# Altium project ServoInterface.PrjPCB
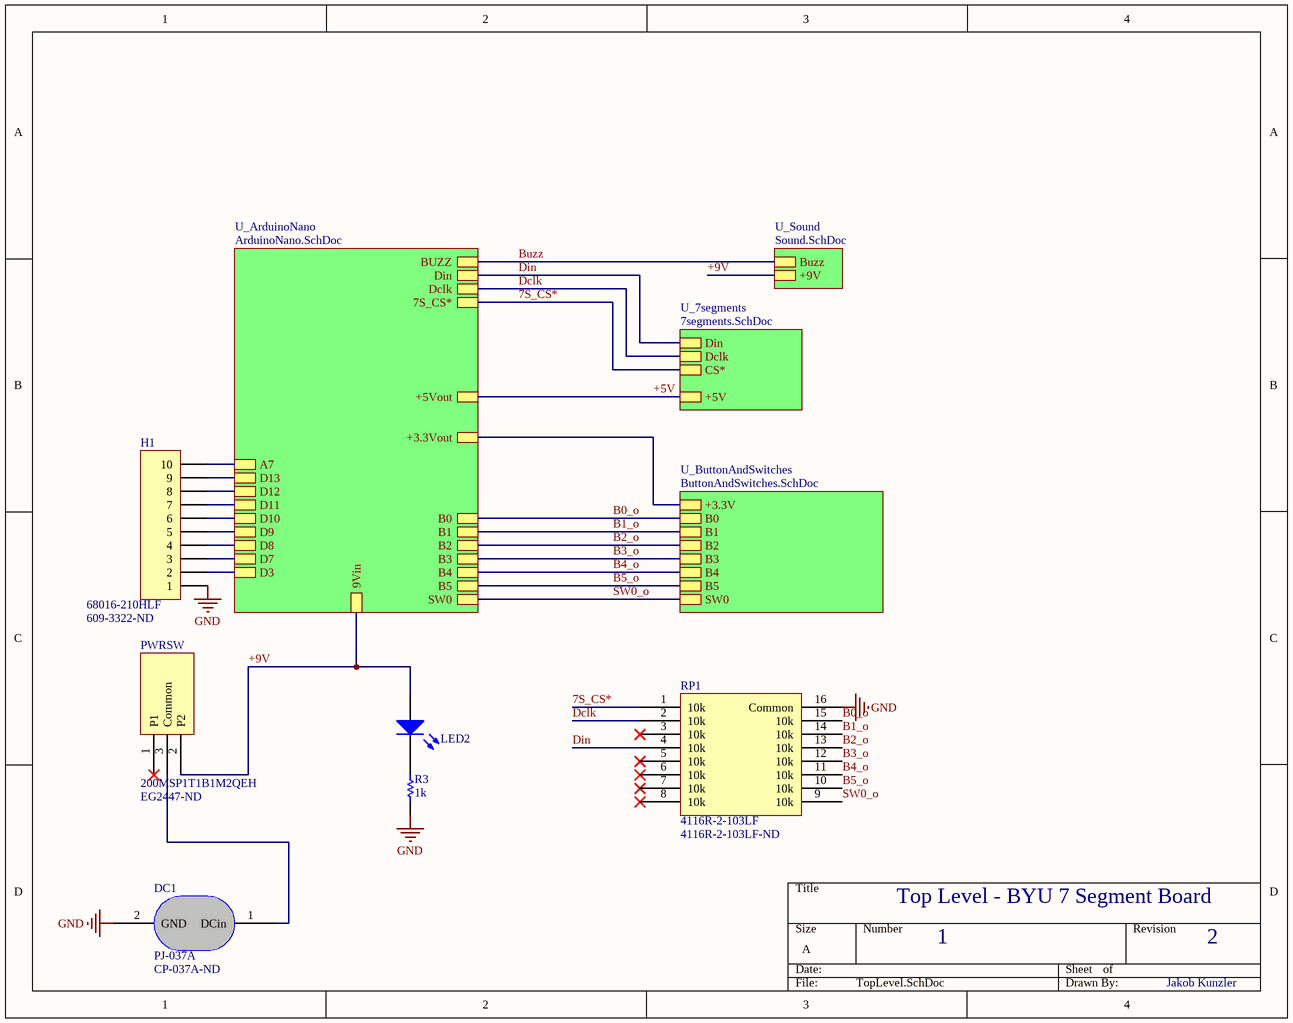
[diagram p0: TopLevel.SchDoc]
5 sheets, 26 parts. Net scope: hierarchical (ports join the sheet entries above them; power ports are global).
Board file: ServoInterface.PcbDoc
Sheets:
  TopLevel.SchDoc
    U_7segments = 7segments.SchDoc
    U_Sound = Sound.SchDoc
    U_ButtonAndSwitches = ButtonAndSwitches.SchDoc
    U_ArduinoNano = ArduinoNano.SchDoc

## Sheet TopLevel.SchDoc
size A

### Parts
DC1  PJ-037A  Supplier Part Number 1: CP-037A-ND  [PJ-037A]
H1  68016-210HLF  Supplier Part Number 1: 609-3322-ND  [Header1X10]
LED2  LTL-4223  [LED Through]  (value not drawn)
PWRSW  200MSP1T1B1M2QEH  Supplier Part Number 1: EG2447-ND  [200MSP1T1B1M2QEH]
R3  1k  [Resistor Through Hole]
RP1  4116R-2-103LF  Supplier Part Number 1: 4116R-2-103LF-ND  [4100R]

### Sub-sheets
U_7segments = 7segments.SchDoc: Din, CS*, Dclk, +5V
U_ArduinoNano = ArduinoNano.SchDoc: Din, D3, Dclk, 7S_CS*, SW0, B5, B4, B3, B2, B1, B0, 9Vin, +5Vout, A7, D13, D12, D11, D10, D9, D8, D7, +3.3Vout, BUZZ
U_ButtonAndSwitches = ButtonAndSwitches.SchDoc: +3.3V, B0, B1, B2, B3, B4, B5, SW0
U_Sound = Sound.SchDoc: Buzz, +9V

### Nets
GND: DC1.2(GND) H1.1 R3.2 RP1.16(Common)
7S_CS*: RP1.1(10k) ; sheet U_7segments/CS*, sheet U_ArduinoNano/7S_CS*
+3.3V: sheet U_ButtonAndSwitches/+3.3V, sheet U_ArduinoNano/+3.3Vout
+5V: sheet U_7segments/+5V, sheet U_ArduinoNano/+5Vout
+9V: LED2.1(A) PWRSW.2(P2) ; sheet U_Sound/+9V, sheet U_ArduinoNano/9Vin
A7: H1.10 ; sheet U_ArduinoNano/A7
B0_o: RP1.15(10k) ; sheet U_ButtonAndSwitches/B0, sheet U_ArduinoNano/B0
B1_o: RP1.14(10k) ; sheet U_ButtonAndSwitches/B1, sheet U_ArduinoNano/B1
B2_o: RP1.13(10k) ; sheet U_ButtonAndSwitches/B2, sheet U_ArduinoNano/B2
B3_o: RP1.12(10k) ; sheet U_ButtonAndSwitches/B3, sheet U_ArduinoNano/B3
B4_o: RP1.11(10k) ; sheet U_ButtonAndSwitches/B4, sheet U_ArduinoNano/B4
B5_o: RP1.10(10k) ; sheet U_ButtonAndSwitches/B5, sheet U_ArduinoNano/B5
Buzz: sheet U_Sound/Buzz, sheet U_ArduinoNano/BUZZ
D3: H1.2 ; sheet U_ArduinoNano/D3
D7: H1.3 ; sheet U_ArduinoNano/D7
D8: H1.4 ; sheet U_ArduinoNano/D8
D9: H1.5 ; sheet U_ArduinoNano/D9
D10: H1.6 ; sheet U_ArduinoNano/D10
D11: H1.7 ; sheet U_ArduinoNano/D11
D12: H1.8 ; sheet U_ArduinoNano/D12
D13: H1.9 ; sheet U_ArduinoNano/D13
Dclk: RP1.2(10k) ; sheet U_7segments/Dclk, sheet U_ArduinoNano/Dclk
Din: RP1.4(10k) ; sheet U_7segments/Din, sheet U_ArduinoNano/Din
SW0_o: RP1.9(10k) ; sheet U_ButtonAndSwitches/SW0, sheet U_ArduinoNano/SW0
NetDC1_1: DC1.1(DCin) PWRSW.3(Common)
NetLED2_2: LED2.2(K) R3.1

Not connected (* = marked no-connect by the designer): PWRSW 1(P1)*; RP1 3(10k)* 5(10k)* 6(10k)* 7(10k)* 8(10k)*

### Notes on the sheet
- Top Level - BYU 7 Segment Board
- 1
- 2
- Jakob Kunzler

### Library data of the parts
DC1 = DCpowerBarrel: CONN PWR JACK 2X5.5MM SOLDER; ComponentLink1Description: CP-037A-ND; ComponentLink1URL: https://www.digikey.com/product-detail/en/cui-inc/PJ-037A/CP-037A-ND/1644545; Supplier 1: Digi-Key
H1 = Header 10 Right Angle 100 mil: LatestRevisionDate: 17-Jul-2002; LatestRevisionNote: Re-released for DXP Platform.; Publisher: Altium Limited; Supplier 1: Digi-Key
LED2 = LED_RED: 2 V drop 10 mA Red; ComponentLink1Description: 160-1127-ND; ComponentLink1URL: https://www.digikey.com/product-detail/en/lite-on-inc/LTL-4223/160-1127-ND/200395; Supplier 1: Digi-Key
PWRSW = PowerSwitch: SWITCH TOGGLE SPDT 3A 120V; ComponentLink1Description: EG2447-ND; ComponentLink1URL: https://www.digikey.com/product-detail/en/e-switch/200MSP1T1B1M2QEH/EG2447-ND/378916; Supplier 1: Digi-Key
R3 = Resistor_1k: CF14JT1K00; Supplier 1: Digi-Key; ComponentLink1Description: CF14JT1K00TR-ND; ComponentLink1URL: https://www.digikey.com/product-detail/en/stackpole-electronics-inc/CF14JT1K00/CF14JT1K00TR-ND/1741314
RP1 = ResistorPack15: Supplier 1: Digi-Key

## Sheet 7segments.SchDoc
size A
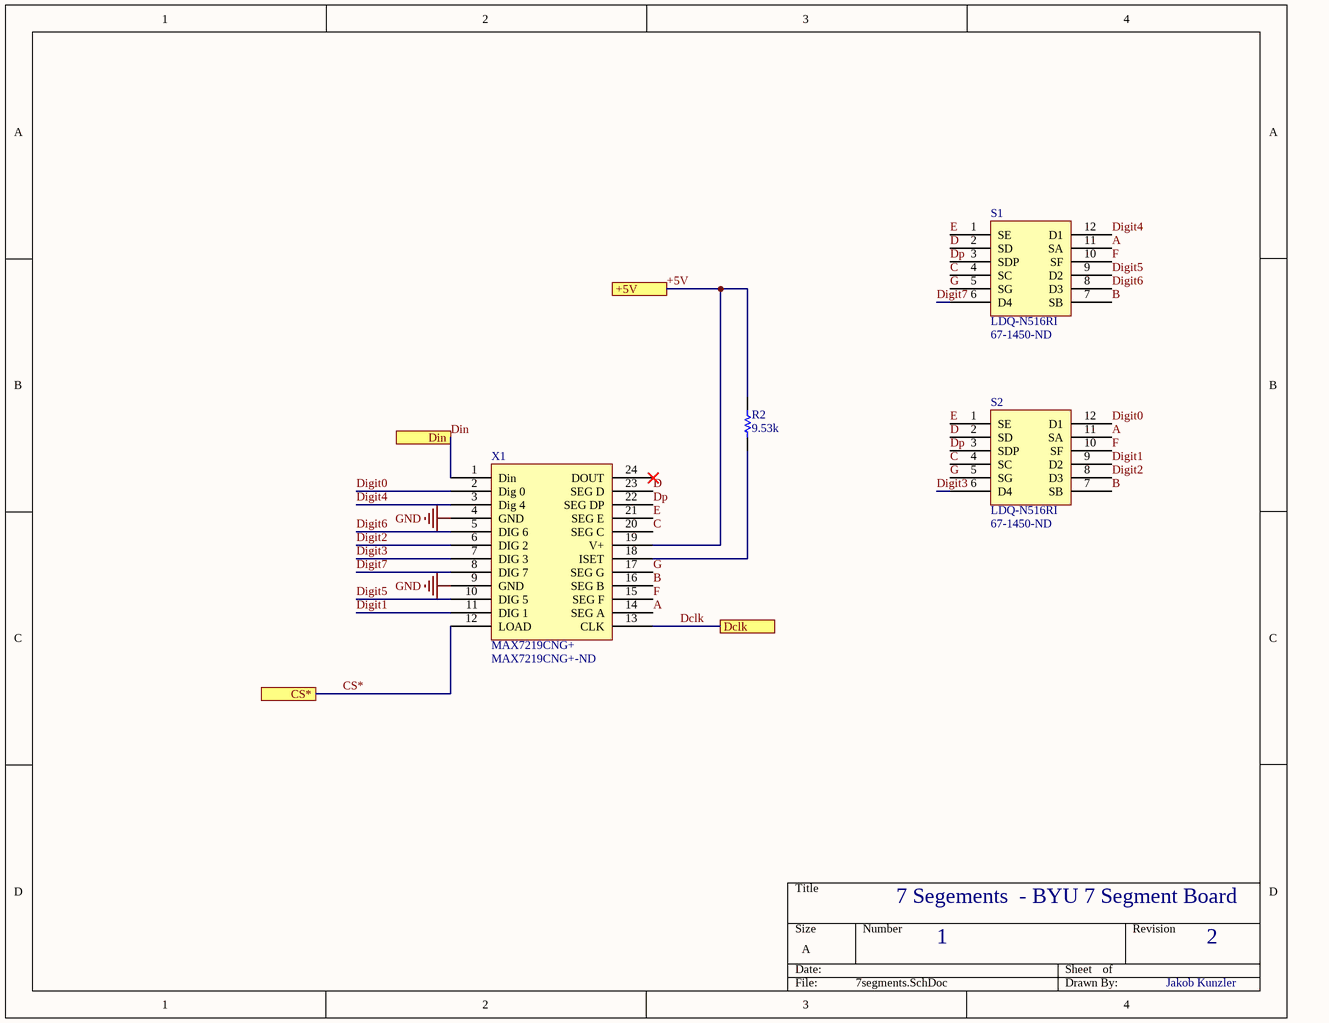
[diagram p1: 7segments.SchDoc]

### Parts
R2  9.53k  [Resistor Through Hole]
S1  LDQ-N516RI  Supplier Part Number 1: 67-1450-ND  [LDQ-516RI]
S2  LDQ-N516RI  Supplier Part Number 1: 67-1450-ND  [LDQ-516RI]
X1  MAX7219CNG+  Supplier Part Number 1: MAX7219CNG+-ND  [MAX7219]

### Ports
+5V, CS*, Dclk, Din

### Nets
GND: X1.4(GND) X1.9(GND)
+5V: R2.2 X1.19(V+) ; port +5V
A: S1.11(SA) S2.11(SA) X1.14(SEG_A)
B: S1.7(SB) S2.7(SB) X1.16(SEG_B)
C: S1.4(SC) S2.4(SC) X1.20(SEG_C)
CS*: X1.12(LOAD) ; port CS*  [project net 7S_CS*]
D: S1.2(SD) S2.2(SD) X1.23(SEG_D)
Dclk: X1.13(CLK) ; port Dclk
Digit0: S2.12(D1) X1.2(Dig_0)
Digit1: S2.9(D2) X1.11(DIG_1)
Digit2: S2.8(D3) X1.6(DIG_2)
Digit3: S2.6(D4) X1.7(DIG_3)
Digit4: S1.12(D1) X1.3(Dig_4)
Digit5: S1.9(D2) X1.10(DIG_5)
Digit6: S1.8(D3) X1.5(DIG_6)
Digit7: S1.6(D4) X1.8(DIG_7)
Din: X1.1(Din) ; port Din
Dp: S1.3(SDP) S2.3(SDP) X1.22(SEG_DP)
E: S1.1(SE) S2.1(SE) X1.21(SEG_E)
F: S1.10(SF) S2.10(SF) X1.15(SEG_F)
G: S1.5(SG) S2.5(SG) X1.17(SEG_G)
NetR2_1: R2.1 X1.18(ISET)

Not connected (* = marked no-connect by the designer): X1 24(DOUT)*

### Notes on the sheet
- 7 Segements  - BYU 7 Segment Board
- 1
- 2
- Jakob Kunzler

### Library data of the parts
R2 = Resistor_9.53k: MFR-25FBF52-9K53; ComponentLink1Description: 9.53KXBK-ND; ComponentLink1URL: https://www.digikey.com/product-detail/en/yageo/MFR-25FBF52-9K53/9.53KXBK-ND/13215; Supplier 1: Digi-Key
S1 S2 = SevenSegment: LED 7-SEG .56 QUAD S-RED CC MULT; ComponentLink1Description: 67-1450-ND; ComponentLink1URL: https://www.digikey.com/products/en?keywords=LDQ-N516RI; Supplier 1: Digi-Key
X1 = MAX7219: Serially Interfaced, 8-Digit LED Display Driver; ComponentLink1Description: MAX7219CNG+-ND; ComponentLink1URL: https://www.digikey.com/product-detail/en/maxim-integrated/MAX7219CNG/MAX7219CNG-ND/948191; Supplier 1: Digi-Key

## Sheet Sound.SchDoc
size A
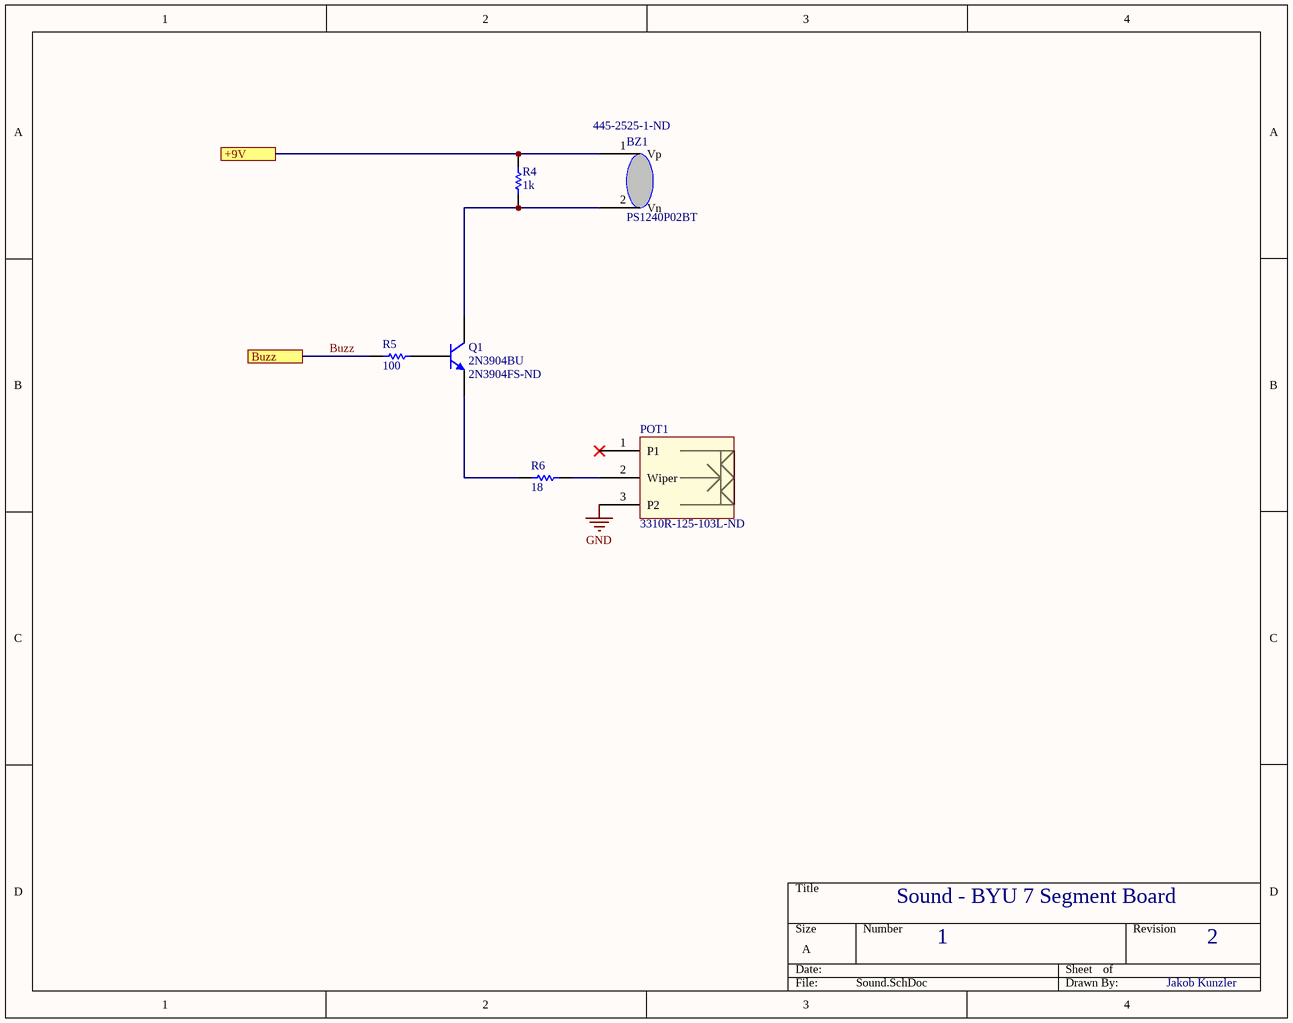
[diagram p2: Sound.SchDoc]

### Parts
BZ1  PS1240P02BT  Supplier Part Number 1: 445-2525-1-ND  [PS1240P02BT]
POT1  Supplier Part Number 1: 3310R-125-103L-ND  [3310R-001]  (hidden comment: 3310R-125-103L)
Q1  2N3904BU  Supplier Part Number 1: 2N3904FS-ND  [2N3904]
R4  1k  [Resistor Through Hole]
R5  100  [Resistor Through Hole]
R6  18  [Resistor Through Hole]

### Ports
+9V, Buzz

### Nets
GND: POT1.3(P2)
+9V: BZ1.1(Vp) R4.1 ; port +9V
Buzz: R5.2 ; port Buzz
NetBZ1_2: BZ1.2(Vn) Q1.3(C) R4.2
NetPOT1_2: POT1.2(Wiper) R6.1
NetQ1_1: Q1.1(E) R6.2
NetQ1_2: Q1.2(B) R5.1

Not connected (* = marked no-connect by the designer): POT1 1(P1)*

### Notes on the sheet
- Sound - BYU 7 Segment Board
- 1
- 2
- Jakob Kunzler

### Library data of the parts
BZ1 = PS12: Piezo Buzzer, Through Hole; ComponentLink1Description: 445-2525-1-ND; ComponentLink1URL: https://www.digikey.com/product-detail/en/tdk-corporation/PS1240P02BT/445-2525-1-ND/935930; Supplier 1: Digi-Key
POT1 = Potentiometer - 10k: POT 10K OHM 1/4W PLASTIC LINEAR; ComponentLink1Description: 3310R-125-103L-ND; ComponentLink1URL: https://www.digikey.com/product-detail/en/bourns-inc/3310R-125-103L/3310R-125-103L-ND/2537840; Supplier 1: Digi-Key
Q1 = 2N3904: TRANS NPN 40V 0.2A TO-92; Published: 8-Jun-2000; LatestRevisionDate: 15-Jan-2003; LatestRevisionNote: PCB Footprint 'BCY-W3/D4.7' replaced; DatasheetVersion: 1997; PackageVersion: Sep-1998; PackageReference: TO-92A; Publisher: Altium Limited; PackageDescription: TO, Flat Index; 3 In-Line, Axial Leads; Body Dia. 4.5mm; Leads 0.51 x 0.48 mm (max); ComponentLink1Description: Manufacturer Link; ComponentLink1URL: http://www.fairchildsemi.com/; ComponentLink2Description: Datasheet; ComponentLink2URL: http://www.fairchildsemi.com/ds/2N%2F2N3904.pdf; Supplier 1: Digi-Key; ComponentLink3Description: 2N3904FS-ND; ComponentLink3URL: https://www.digikey.com/product-detail/en/on-semiconductor/2N3904BU/2N3904FS-ND/1413
R4 = Resistor_1k: CF14JT1K00; Supplier 1: Digi-Key; ComponentLink1Description: CF14JT1K00TR-ND; ComponentLink1URL: https://www.digikey.com/product-detail/en/stackpole-electronics-inc/CF14JT1K00/CF14JT1K00TR-ND/1741314
R5 = Resistor_100: CF14JT100R; ComponentLink1Description: CF14JT100RCT-ND; ComponentLink1URL: https://www.digikey.com/product-detail/en/stackpole-electronics-inc/CF14JT100R/CF14JT100RCT-ND/1830327; Supplier 1: Digi-Key
R6 = Resistor_18: CF14JT18R0; Supplier 1: Digi-Key

## Sheet ButtonAndSwitches.SchDoc
size A
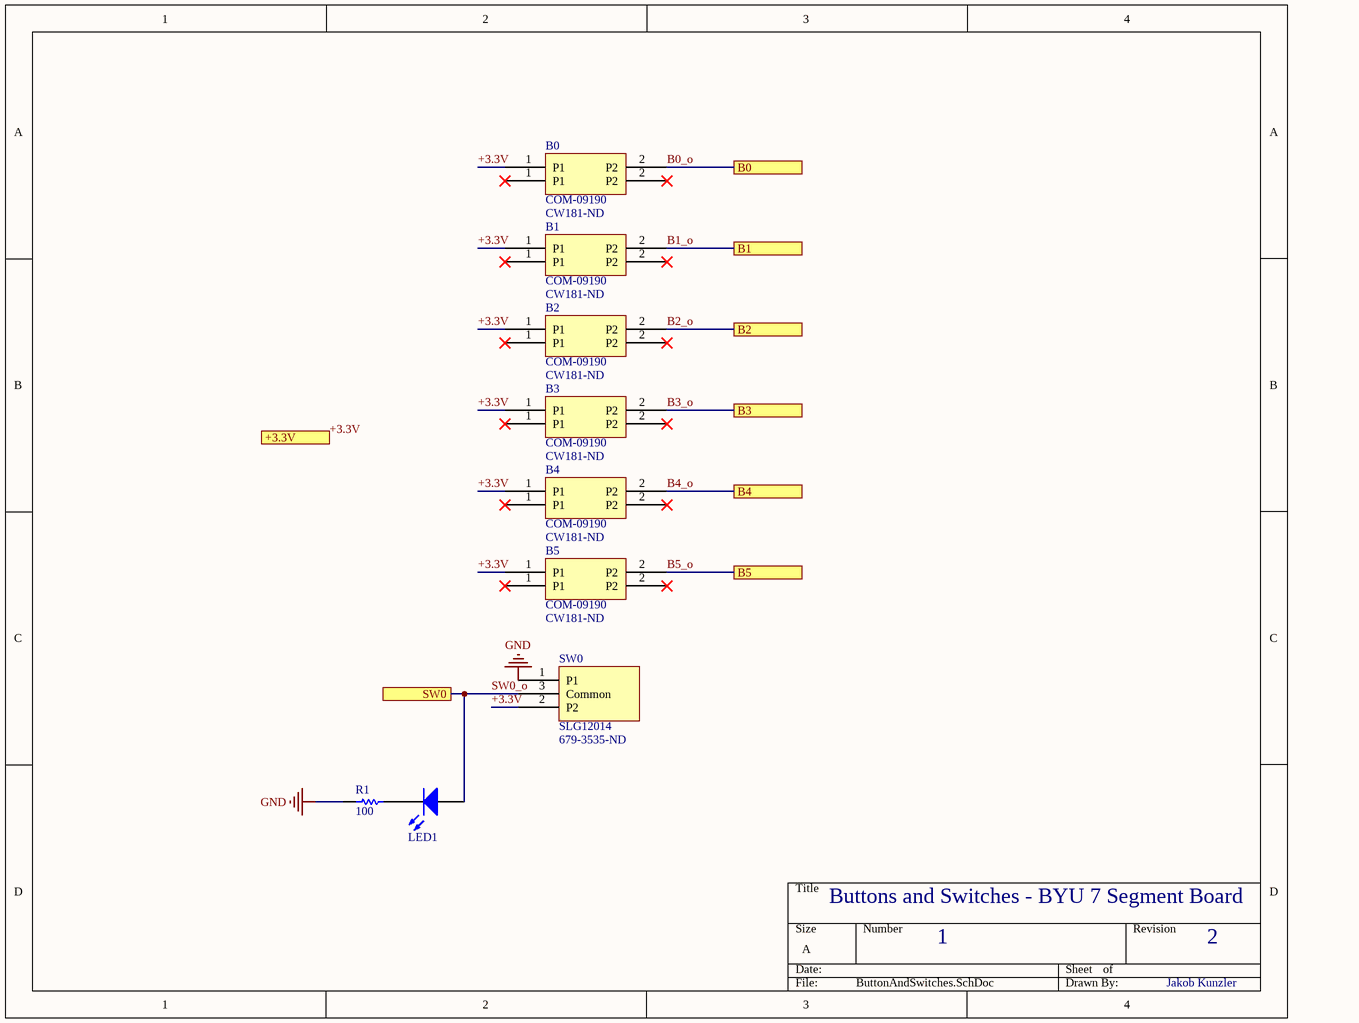
[diagram p3: ButtonAndSwitches.SchDoc]

### Parts
B0  COM-09190  Supplier Part Number 1: CW181-ND  [COM-09190]
B1  COM-09190  Supplier Part Number 1: CW181-ND  [COM-09190]
B2  COM-09190  Supplier Part Number 1: CW181-ND  [COM-09190]
B3  COM-09190  Supplier Part Number 1: CW181-ND  [COM-09190]
B4  COM-09190  Supplier Part Number 1: CW181-ND  [COM-09190]
B5  COM-09190  Supplier Part Number 1: CW181-ND  [COM-09190]
LED1  LTL-4223  [LED Through]  (value not drawn)
R1  100  [Resistor Through Hole]
SW0  SLG12014  Supplier Part Number 1: 679-3535-ND  [SLG12014]

### Ports
+3.3V, B0, B1, B2, B3, B4, B5, SW0

### Nets
GND: R1.2 SW0.1(P1)
+3.3V: B0.1(P1) B1.1(P1) B2.1(P1) B3.1(P1) B4.1(P1) B5.1(P1) SW0.2(P2) ; port +3.3V
B0_o: B0.2(P2) ; port B0
B1_o: B1.2(P2) ; port B1
B2_o: B2.2(P2) ; port B2
B3_o: B3.2(P2) ; port B3
B4_o: B4.2(P2) ; port B4
B5_o: B5.2(P2) ; port B5
SW0_o: LED1.1(A) SW0.3(Common) ; port SW0
NetLED1_2: LED1.2(K) R1.1

### Notes on the sheet
- Buttons and Switches - BYU 7 Segment Board
- 1
- 2
- Jakob Kunzler

### Library data of the parts
B0-B5 = Push Button_Tactile: Momentary Pushbutton Switch - 12mm Square; Supplier 1: Digi-Key; ComponentLink2Description: Momentary Pushbutton Switch - 12mm Square; ComponentLink2URL: https://www.sparkfun.com/products/9190
LED1 = LED_RED: 2 V drop 10 mA Red; ComponentLink1Description: 160-1127-ND; ComponentLink1URL: https://www.digikey.com/product-detail/en/lite-on-inc/LTL-4223/160-1127-ND/200395; Supplier 1: Digi-Key
R1 = Resistor_100: CF14JT100R; ComponentLink1Description: CF14JT100RCT-ND; ComponentLink1URL: https://www.digikey.com/product-detail/en/stackpole-electronics-inc/CF14JT100R/CF14JT100RCT-ND/1830327; Supplier 1: Digi-Key
SW0 = SlideSwitch: SWITCH SLIDE SPDT 300MA 125V; ComponentLink1Description: 679-3535-ND; ComponentLink1URL: https://www.digikey.com/product-detail/en/apem-inc/SLG12014/679-3535-ND/1797348; Supplier 1: Digi-Key

## Sheet ArduinoNano.SchDoc
size A
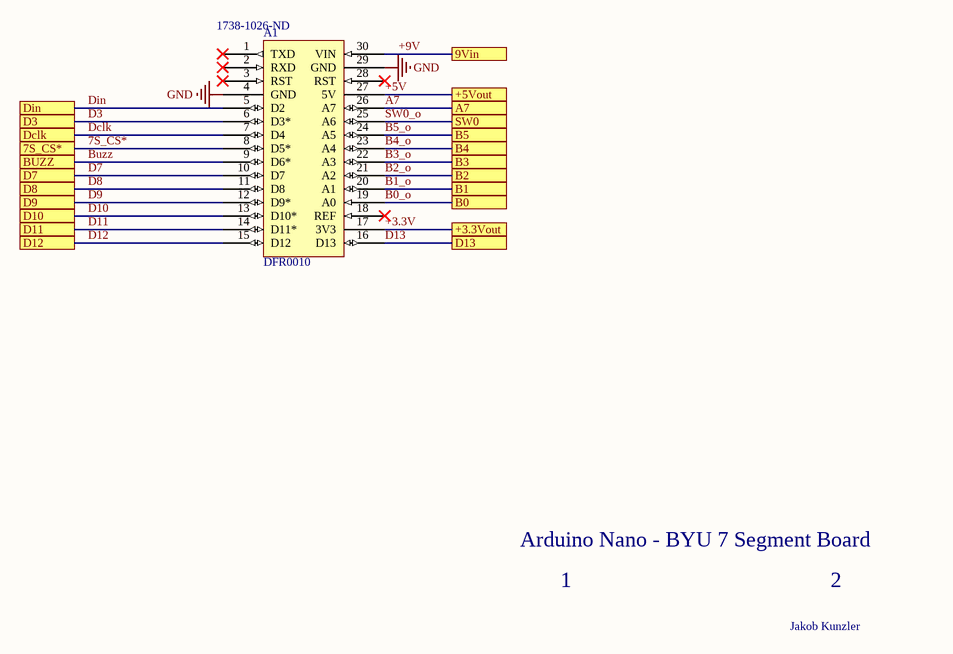
[diagram p4: ArduinoNano.SchDoc]

### Parts
A1  DFR0010  Supplier Part Number 1: 1738-1026-ND  [ArduinoNano]

### Ports
7S_CS*, 9Vin, +3.3Vout, +5Vout, A7, B0, B1, B2, B3, B4, B5, BUZZ, D3, D7, D8, D9, D10, D11, D12, D13, Dclk, Din, SW0

### Nets
GND: A1.4(GND) A1.29(GND)
7S_CS*: A1.8(D5*) ; port 7S_CS*
+3.3V: A1.17(3V3) ; port +3.3Vout
+5V: A1.27(5V) ; port +5Vout
+9V: A1.30(VIN) ; port 9Vin
A7: A1.26(A7) ; port A7
B0_o: A1.19(A0) ; port B0
B1_o: A1.20(A1) ; port B1
B2_o: A1.21(A2) ; port B2
B3_o: A1.22(A3) ; port B3
B4_o: A1.23(A4) ; port B4
B5_o: A1.24(A5) ; port B5
Buzz: A1.9(D6*) ; port BUZZ
D3: A1.6(D3*) ; port D3
D7: A1.10(D7) ; port D7
D8: A1.11(D8) ; port D8
D9: A1.12(D9*) ; port D9
D10: A1.13(D10*) ; port D10
D11: A1.14(D11*) ; port D11
D12: A1.15(D12) ; port D12
D13: A1.16(D13) ; port D13
Dclk: A1.7(D4) ; port Dclk
Din: A1.5(D2) ; port Din
SW0_o: A1.25(A6) ; port SW0

Not connected (* = marked no-connect by the designer): A1 1(TXD)* 2(RXD)* 3(RST)* 18(REF)* 28(RST)*

### Notes on the sheet
- Arduino Nano - BYU 7 Segment Board
- 1
- 2
- Jakob Kunzler

### Library data of the parts
A1 = ArduinoNano: DFRDUINO NANO V3.1 (ARDUINO NANO; ComponentLink1Description: 1738-1026-ND; ComponentLink1URL: https://www.digikey.com/product-detail/en/dfrobot/DFR0010/1738-1026-ND/6588448; Supplier 1: Digi-Key

## Nets that join several sheets
GND: TopLevel (DC1.2 H1.1 R3.2 RP1.16), 7segments (X1.4 X1.9), Sound (POT1.3), ButtonAndSwitches (R1.2 SW0.1), ArduinoNano (A1.4 A1.29)
7S_CS*: TopLevel (RP1.1), 7segments (X1.12), ArduinoNano (A1.8)
+3.3V: ButtonAndSwitches (7 pins), ArduinoNano (A1.17)
+5V: 7segments (R2.2 X1.19), ArduinoNano (A1.27)
+9V: TopLevel (LED2.1 PWRSW.2), Sound (BZ1.1 R4.1), ArduinoNano (A1.30)
A7: TopLevel (H1.10), ArduinoNano (A1.26)
B0_o: TopLevel (RP1.15), ButtonAndSwitches (B0.2), ArduinoNano (A1.19)
B1_o: TopLevel (RP1.14), ButtonAndSwitches (B1.2), ArduinoNano (A1.20)
B2_o: TopLevel (RP1.13), ButtonAndSwitches (B2.2), ArduinoNano (A1.21)
B3_o: TopLevel (RP1.12), ButtonAndSwitches (B3.2), ArduinoNano (A1.22)
B4_o: TopLevel (RP1.11), ButtonAndSwitches (B4.2), ArduinoNano (A1.23)
B5_o: TopLevel (RP1.10), ButtonAndSwitches (B5.2), ArduinoNano (A1.24)
Buzz: Sound (R5.2), ArduinoNano (A1.9)
D3: TopLevel (H1.2), ArduinoNano (A1.6)
D7: TopLevel (H1.3), ArduinoNano (A1.10)
D8: TopLevel (H1.4), ArduinoNano (A1.11)
D9: TopLevel (H1.5), ArduinoNano (A1.12)
D10: TopLevel (H1.6), ArduinoNano (A1.13)
D11: TopLevel (H1.7), ArduinoNano (A1.14)
D12: TopLevel (H1.8), ArduinoNano (A1.15)
D13: TopLevel (H1.9), ArduinoNano (A1.16)
Dclk: TopLevel (RP1.2), 7segments (X1.13), ArduinoNano (A1.7)
Din: TopLevel (RP1.4), 7segments (X1.1), ArduinoNano (A1.5)
SW0_o: TopLevel (RP1.9), ButtonAndSwitches (LED1.1 SW0.3), ArduinoNano (A1.25)